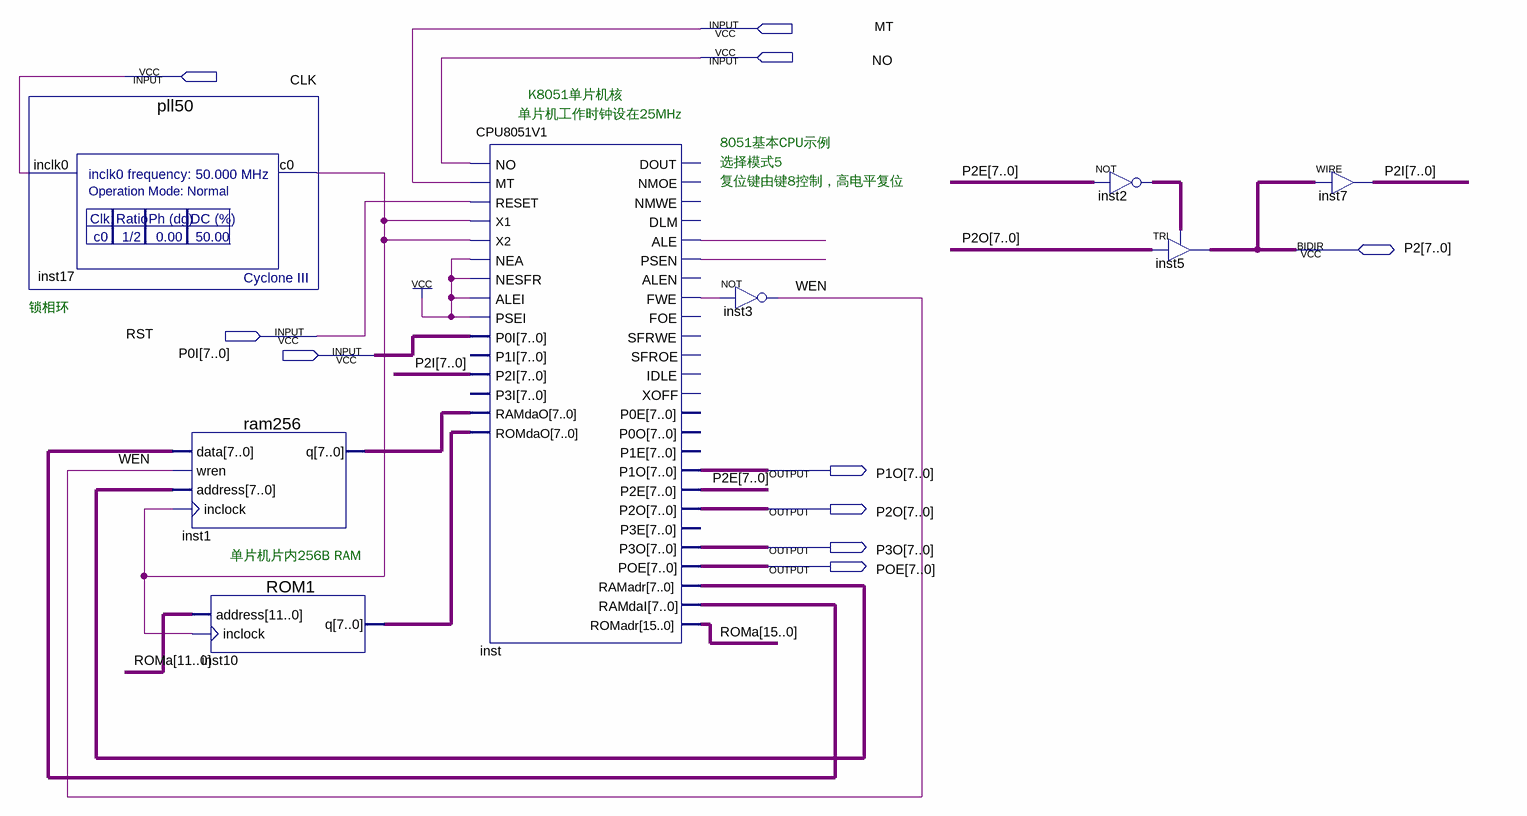
[diagram p0: schematic sheet]
// Quartus schematic MCU8951.bdf as structural Verilog: 8 symbols, 10 pins
module MCU8951 (
  input  MT,
  input  NO,
  input  CLK,
  input  RST,
  input  [7:0] P0I,
  inout  [7:0] P2,
  output [7:0] P1O,
  output [7:0] P2O,
  output [7:0] P3O,
  output [7:0] POE
);

  wire inst17_c0, inst_ale, inst_fwe, inst_psen, WEN;
  wire [7:0] inst1_q, inst2_out, inst10_q, inst_ramadr, inst_ramdai, P2E, P2I;
  wire [15:0] ROMa;

  pll50 inst17 (.inclk0(CLK), .c0(inst17_c0));
  ram256 inst1 (.data(inst_ramdai), .wren(WEN), .address(inst_ramadr), .inclock(inst17_c0), .q(inst1_q));
  ROM1 inst10 (.address(ROMa[11:0]), .inclock(inst17_c0), .q(inst10_q));
  CPU8051V1 inst (
    .NO(NO), .MT(MT), .RESET(RST), .X1(inst17_c0), .X2(inst17_c0), .NEA(1'b1), .NESFR(1'b1), .ALEI(1'b1),
    .PSEI(1'b1), .P0I(P0I), .P2I(P2I), .RAMdaO(inst1_q), .ROMdaO(inst10_q), .ALE(inst_ale), .PSEN(inst_psen),
    .FWE(inst_fwe), .P1O(P1O), .P2E(P2E), .P2O(P2O), .P3O(P3O), .POE(POE), .RAMadr(inst_ramadr),
    .RAMdaI(inst_ramdai), .ROMadr(ROMa));  // open: P1I, P3I, DOUT, NMOE, NMWE, DLM, ALEN, FOE, SFRWE, SFROE, IDLE, XOFF, P0E, P0O, P1E, P3E
  not inst3 (WEN, inst_fwe);
  assign inst2_out = ~P2E;  // NOT inst2, 8 bits wide
  TRI inst5[7:0] (.IN(P2O), .OE(inst2_out), .OUT(P2));
  assign P2I = P2;  // WIRE inst7

  // Notes on the sheet:
  //   K8051单片机核
  //   单片机工作时钟设在25MHz
  //   8051基本CPU示例
  //   选择模式5
  //   复位键由键8控制，高电平复位
  //   锁相环
  //   单片机片内256B RAM
endmodule
